# EAGLE design fingertip_12line_outlined_2 (EAGLE 9.6.2)
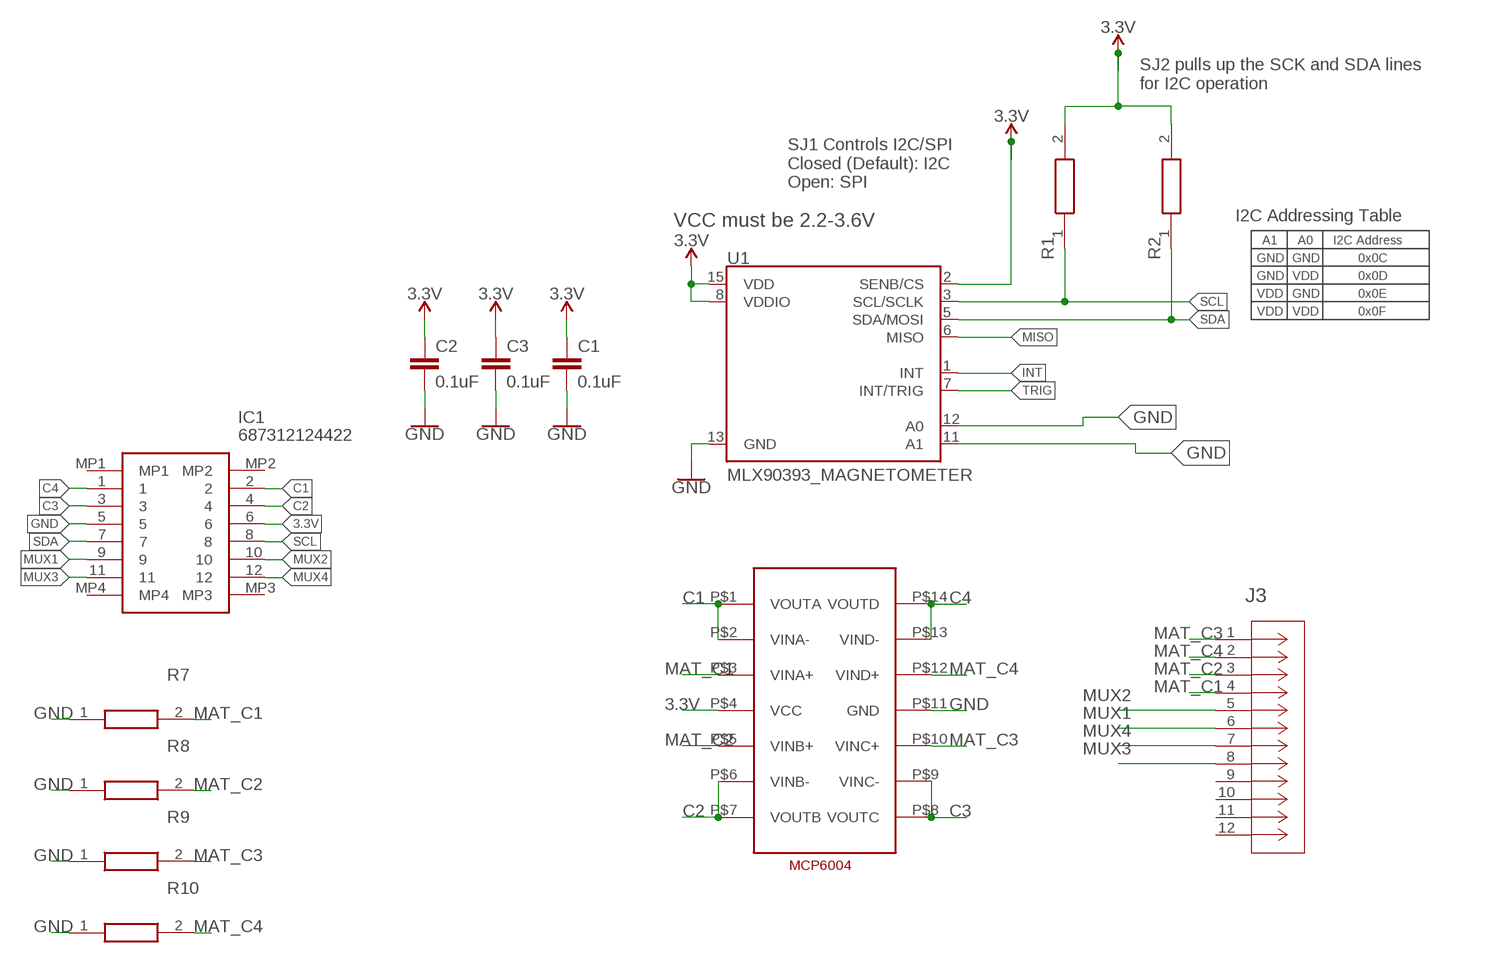
[diagram p0: schematic, sheet 1]

## Parts
C1  0.1uF  0.1UF-0402-16V-10%  [0402]
C2  0.1uF  0.1UF-0402-16V-10%  [0402]
C3  0.1uF  0.1UF-0402-16V-10%  [0402]
IC1  687312124422  [687312124422]
J3  FH12-8S-1SV(55)  [CON8_1X8_DUTB1_HRS_HIR]
R1  ERJ-S02J103X  [RESC1005X40N]
R2  ERJ-S02J103X  [RESC1005X40N]
R7  ERJ-S02J103X  [RESC1005X40N]
R8  ERJ-S02J103X  [RESC1005X40N]
R9  ERJ-S02J103X  [RESC1005X40N]
R10  ERJ-S02J103X  [RESC1005X40N]
U1  MLX90393_MAGNETOMETER  [QFN-16_WITH_AXIES]
U$2  DECADE-MCP6004  [DECADE-MCP6003]

## Nets
3.3V: C1.1 C2.1 C3.1 IC1.6 R1.2 R2.2 U1.2(SENB/CS) U1.8(VDDIO) U1.15(VDD) U$2.P$4(VCC)
C1: IC1.2 U$2.P$1(VOUTA) U$2.P$2(VINA-)
C2: IC1.4 U$2.P$6(VINB-) U$2.P$7(VOUTB)
C3: IC1.3 U$2.P$8(VOUTC) U$2.P$9(VINC-)
C4: IC1.1 U$2.P$13(VIND-) U$2.P$14(VOUTD)
GND: C1.2 C2.2 C3.2 IC1.5 R7.1 R8.1 R9.1 R10.1 U1.11(A1) U1.12(A0) U1.13(GND) U$2.P$11(GND)
INT: U1.1(INT)
MAT_C1: J3.4 R7.2 U$2.P$3(VINA+)
MAT_C2: J3.3 R8.2 U$2.P$5(VINB+)
MAT_C3: J3.1 R9.2 U$2.P$10(VINC+)
MAT_C4: J3.2 R10.2 U$2.P$12(VIND+)
MISO: U1.6(MISO)
MUX1: IC1.9 J3.6
MUX2: IC1.10 J3.5
MUX3: IC1.11 J3.8
MUX4: IC1.12 J3.7
SCL: IC1.8 R1.1 U1.3(SCL/SCLK)
SDA: IC1.7 R2.1 U1.5(SDA/MOSI)
TRIG: U1.7(INT/TRIG)
Unconnected: IC1.MP1 IC1.MP2 IC1.MP3 IC1.MP4 J3.9 J3.10 J3.11 J3.12

## Notes on the sheet
- SJ2 pulls up the SCK and SDA lines
  for I2C operation
- SJ1 Controls I2C/SPI
  Closed (Default): I2C
  Open: SPI
- VCC must be 2.2-3.6V
- I2C Addressing Table
- A1 | A0 | I2C Address
- GND | GND | 0x0C
- GND | VDD | 0x0D
- VDD | GND | 0x0E
- VDD | VDD | 0x0F

## Library data of the parts
C1-C3 = SparkFun-Capacitors:0.1UF: 0.1µF ceramic capacitors A capacitor is a passive two-terminal electrical component used to store electrical energy temporarily in an electric field.; PROD_ID: CAP-12416
IC1 = SamacSys_Parts:687312124422: FFC & FPC Connectors WR-FPC 0.5mm SMT ZIF 12Pin Vertical Source: Datasheet <https://katalog.we-online.de/pbs/datasheet/331031271520.pdf>; DESCRIPTION: FFC & FPC Connectors WR-FPC 0.5mm SMT ZIF 12Pin Vertical; HEIGHT: 5.5mm; MANUFACTURER_NAME: Wurth Elektronik; MANUFACTURER_PART_NUMBER: 687312124422; MOUSER_PART_NUMBER: 710-687312124422; MOUSER_PRICE-STOCK: https://www.mouser.co.uk/ProductDetail/Wurth-Elektronik/687312124422?qs=qR1qlUC5%2FYRUvnivsXiYUw%3D%3D
J3 = my-library:FH12-8S-1SV(55); BUILT_BY: EMA_Kyle; COPYRIGHT: Copyright (C) 2018 Accelerated Designs. All rights reserved; MANUFACTURER_PART_NUMBER: FH12-8S-1SV(55); SOURCELIBRARY: Hirose_2008-01-01; VENDOR: Hirose
R1 R2 R7-R10 = SamacSys_Parts:ERJ-S02J103X: Thick Film Resistors - SMD 0402 10Kohms 5% Anti-Sulfur Source: Datasheet <https://industrial.panasonic.com/cdbs/www-data/pdf/RDP0000/AOA0000C334.pdf>; DESCRIPTION: Thick Film Resistors - SMD 0402 10Kohms 5% Anti-Sulfur; HEIGHT: 0.4mm; MANUFACTURER_NAME: Panasonic; MANUFACTURER_PART_NUMBER: ERJ-S02J103X
U1 = SparkFun-Sensors:MLX90393_MAGNETOMETER; PROD_ID: SEN-13886
U$2 = DECADE-libraries20151104:DECADE-MCP6004

## Board
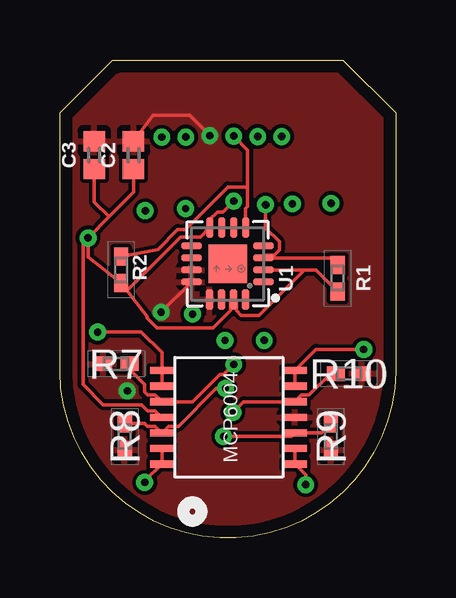
[diagram p1: board, top side]
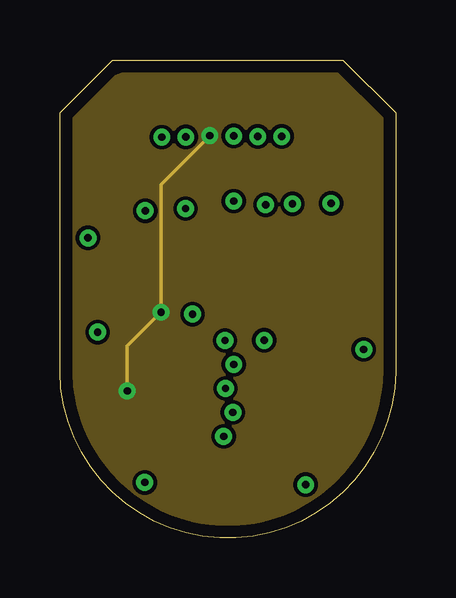
[diagram p2: board, inner layer Route2]
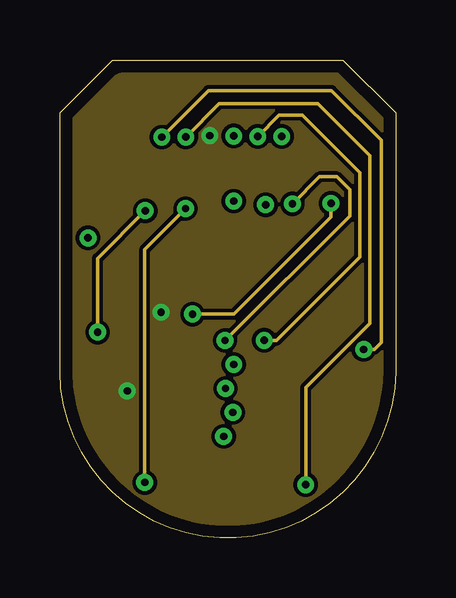
[diagram p3: board, inner layer Route15]
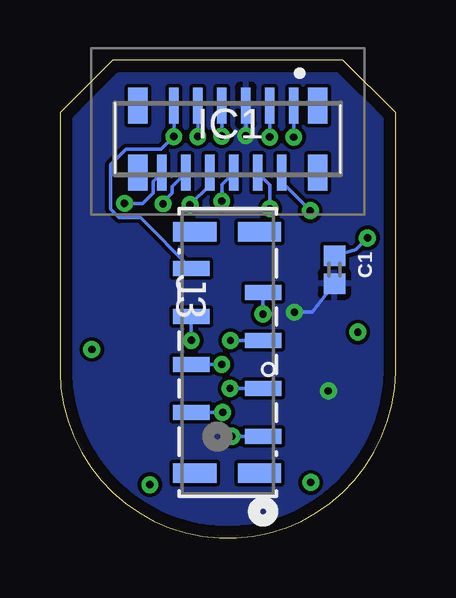
[diagram p4: board, bottom side, seen from below]

Size 14 x 19.94 mm. Coordinates in mm from the lower left corner, seen from the top.
Outline: 0,6.94 0,17.74 2.2,19.94 11.8,19.94 14,17.74 14,6.94 arc-179 0,6.94
Copper layers (1+2*15+16): Top 0.035mm / dielectric 0.2mm / Route2 0.0175mm / dielectric 1.065mm / Route15 0.0175mm / dielectric 0.2mm / Bottom 0.035mm
Design rules "default *": minimum track width 6mil, minimum drill 0.3mm, track to track 6mil, track to pad 6mil, pad to pad 6mil, via to via 6mil, smd to smd 6mil, copper to edge 20mil, drill to drill 6mil, minimum pad ring 10mil, minimum via ring 8mil, stop-mask expansion 4mil, vias tented up to drill 0mil, thermal gap 10mil

### Footprints (pad centres in the part's own frame; a part is rotated, then mirrored left to right if it is on the bottom)
0402 = smd 0.85 x 0.9: 1 -0.58,0; 2 0.58,0
687312124422 = smd 0.4 x 1.5: 1 -2.75,-1.4; 2 -2.25,1.4; 3 -1.75,-1.4; 4 -1.25,1.4; 5 -0.75,-1.4; 6 -0.25,1.4; 7 0.25,-1.4; 8 0.75,1.4; 9 1.25,-1.4; 10 1.75,1.4; 11 2.25,-1.4; 12 2.75,1.4 | smd 0.8 x 1.5: MP1 -3.75,-1.4; MP2 -3.75,1.4; MP3 3.75,1.4; MP4 3.75,-1.4
CON8_1X8_DUTB1_HRS_HIR = smd 0.61 x 1.524: 1 3.5,1.473; 2 2.5,-1.524; 3 1.5,1.473; 4 0.5,-1.524; 5 -0.5,1.473; 6 -1.5,-1.524; 7 -2.5,1.473; 8 -3.5,-1.524 | smd 0.813 x 1.803: 9 -5.029,-1.372; 10 5.029,-1.372; 11 -5.029,1.321; 12 5.029,1.321
RESC1005X40N = smd 0.75 x 0.6: 1 -0.55,0; 2 0.55,0
QFN-16_WITH_AXIES = smd 0.3 x 0.85: 1 0.754,1.498; 2 0.254,1.498; 3 -0.246,1.498; 4 -0.746,1.498; 9 -0.746,-1.506; 10 -0.246,-1.506; 11 0.254,-1.506; 12 0.754,-1.506 | smd 0.85 x 0.3: 5 -1.508,0.746; 6 -1.508,0.246; 7 -1.508,-0.254; 8 -1.508,-0.754; 13 1.496,-0.764; 14 1.496,-0.264; 15 1.496,0.236; 16 1.496,0.736 | smd 1.6 x 1.6: 17 0,0
DECADE-MCP6003 = smd 1 x 0.3: P$1 2.75,-2.05; P$2 2.75,-1.4; P$3 2.75,-0.75; P$4 2.75,-0.1; P$5 2.75,0.55; P$6 2.75,1.2; P$7 2.75,1.85; P$8 -2.8,1.85; P$9 -2.8,1.2; P$10 -2.8,0.55; P$11 -2.8,-0.1; P$12 -2.8,-0.75; P$13 -2.8,-1.4; P$14 -2.8,-2.05

### Placement (x,y rotation side)
C1  2.55,11.19 270 bottom
C2  3.07,15.97 90 top
C3  1.43,15.97 90 top
IC1  7,16.64 180 bottom
J3  7,7.74 270 bottom
R1  11.58,10.84 270 top
R2  2.55,11.19 270 top
R7  2.35,7.27 0 top
R8  2.7,4.24 90 top
R9  11.3,4.24 90 top
R10  12.05,6.86 180 top
U1  7,11.44 270 top
U$2  7,4.94 180 top

### Tracks (layer width: path | path; a pad name or v marks a point on that pad's centre or on a via)
3.3V  (via drill 0.3)
  Top 0.152: v7.25,14.05 6.79,13.6 6.57,13.6 6.25,13.28 U1.8 5.86,12.56 5.04,12.56 2.82,10.34 R2.2 | R2.2 3.64,9.25 3.64,9.17 4.06,8.75 6.38,8.75 7.12,9.49 7.12,9.82 U1.15 7.36,9.82 7.36,9.49 7.56,9.29 8.29,9.29 10.19,11.18 | v1.17,12.52 1.17,11.72 R2.2 | U$2.P$4 3.98,5.31 3.65,5.31 3.41,5.55 1.8,5.55 0.96,6.4 0.96,12.31 v1.17,12.52 | C2.1 3.07,14.42 2.05,13.4 | 2.05,13.4 v1.17,12.52 | C3.1 1.43,14.02 2.05,13.4 | U1.2 10.19,11.18 | 10.19,11.18 10.68,11.18 R1.2
  Bottom 0.152: IC1.6 7.25,14.74 v7.25,14.05 | C1.1 1.65,12.04 v1.17,12.52
C1  (via drill 0.3)
  Top 0.152: U$2.P$2 U$2.P$1 4.25,7.74 3.39,8.6 3.38,8.59 v1.57,8.59
  Route15 0.152: v1.57,8.59 1.57,11.66 v3.56,13.65
  Bottom 0.152: IC1.2 4.75,14.84 v3.56,13.65
C2  (via drill 0.3)
  Top 0.152: v3.54,2.32 3.54,2.38 U$2.P$7 U$2.P$6
  Route15 0.152: v3.54,2.32 3.54,12.04 v5.24,13.74
  Bottom 0.152: IC1.4 5.24,14.73 v5.24,13.74
C3  (via drill 0.3)
  Top 0.152: U$2.P$9 U$2.P$8 10.25,2.64 v10.25,2.23
  Route15 0.152: v10.25,2.23 10.25,6.28 12.92,8.95 12.92,15.96 10.77,18.11 6.63,18.11 v5.25,16.73
  Bottom 0.152: IC1.3 v5.25,16.73
C4  (via drill 0.3)
  Top 0.152: U$2.P$13 U$2.P$14 10.68,7.87 v12.67,7.87
  Route15 0.152: v12.67,7.87 13.12,7.87 13.4,8.15 13.4,16.59 11.33,18.66 6.19,18.66 v4.25,16.72
  Bottom 0.152: IC1.1 v4.25,16.72
GND  (via drill 0.3)
  Top 0.152: U1.12 v4.23,9.42 v4.22,9.42 | C2.2 3.88,17.63 5.4,17.63 v6.25,16.78
  Route2 0.152: v6.25,16.78 4.22,14.75 v4.22,9.42 2.81,8.01 v2.81,6.13
  Bottom 0.152: IC1.5 v6.25,16.78 | C1.2 3.47,9.42 v4.22,9.42
  pour Top: 0.19,16.17 0.19,7.02 arc90 6.75,0.45 arc90 13.7,7.4 13.7,16.56 arc90 10.77,19.49 3.51,19.49 arc90
  pour Bottom: 0.28,16.08 0.28,7.22 arc90 6.97,0.53 arc90 13.65,7.21 13.65,16.63 arc90 10.74,19.54 3.14,19.54 arc90
  pour Route15: 0.28,16.1 0.28,7.18 arc90 6.96,0.5 arc90 13.7,7.24 13.7,16.48 arc90 10.63,19.55 3.73,19.55 arc90
  pour Route2: 0.3,16.19 0.3,7.09 arc90 6.93,0.45 arc90 13.71,7.23 13.71,16.54 arc90 10.74,19.51 3.62,19.51 arc90
MAT_C1  (via drill 0.3)
  Top 0.152: v7.25,7.24 6.83,6.82 6.67,6.82 5.54,5.69 U$2.P$3 3.98,5.96 3.65,5.96 3.52,6.09 3.52,6.41 2.9,7.04 R7.2
  Bottom 0.152: J3.4 v7.25,7.24
MAT_C2  (via drill 0.3)
  Top 0.152: R8.2 3.53,4.79 3.65,4.66 3.98,4.66 U$2.P$5 4.52,4.66 4.94,4.66 6.52,6.24 v6.91,6.24
  Bottom 0.152: J3.3 v6.91,6.24
MAT_C3  (via drill 0.3)
  Top 0.152: v6.83,4.24 9.65,4.24 U$2.P$10 10.9,4.39 R9.2
  Bottom 0.152: J3.1 v6.83,4.24
MAT_C4  (via drill 0.3)
  Top 0.152: R10.2 11.29,6.86 10.39,5.96 10.07,5.96 U$2.P$12 7.66,5.69 v7.21,5.24
  Bottom 0.152: J3.2 v7.21,5.24
MUX1  (via drill 0.3)
  Route15 0.152: v8.52,8.25 9.04,8.25 12.52,11.73 12.52,15.24 10.12,17.64 9.14,17.64 v8.25,16.75
  Bottom 0.152: IC1.9 v8.25,16.75 | J3.6 v8.52,8.25
MUX2  (via drill 0.3)
  Route15 0.152: v6.89,8.24 12.09,13.44 12.09,14.53 11.55,15.07 10.83,15.07 v9.7,13.94
  Bottom 0.152: IC1.10 9.32,14.66 9.32,14.39 9.7,14.01 v9.7,13.94 | J3.5 v6.89,8.24
MUX3  (via drill 0.3)
  Bottom 0.152: IC1.11 v9.25,16.75 9.78,16.21 11.25,16.21 11.89,15.57 11.89,13.71 11.53,13.35 10.64,13.35 J3.8
MUX4  (via drill 0.3)
  Route15 0.152: v5.53,9.34 7.27,9.34 11.31,13.38 v11.31,13.96
  Bottom 0.152: IC1.12 10.12,14.86 10.12,14.39 10.56,13.96 v11.31,13.96 | J3.7 v5.53,9.34
SCL  (via drill 0.3)
  Top 0.152: v8.58,13.9 8.58,12.93 9.15,12.36 9.15,12 8.95,11.8 8.62,11.8 U1.3 11.58,11.68 R1.1
  Bottom 0.152: IC1.8 7.75,14.73 v8.58,13.9
SDA  (via drill 0.3)
  Top 0.152: U1.5 7.75,13.73 7.83,13.81 7.83,14.67 | v7.25,16.77 7.83,16.18 7.83,14.67 | R2.1 4.08,12.04 4.91,12.86 5.24,12.86 7.01,14.64 7.8,14.64 7.83,14.67
  Bottom 0.152: IC1.7 v7.25,16.77